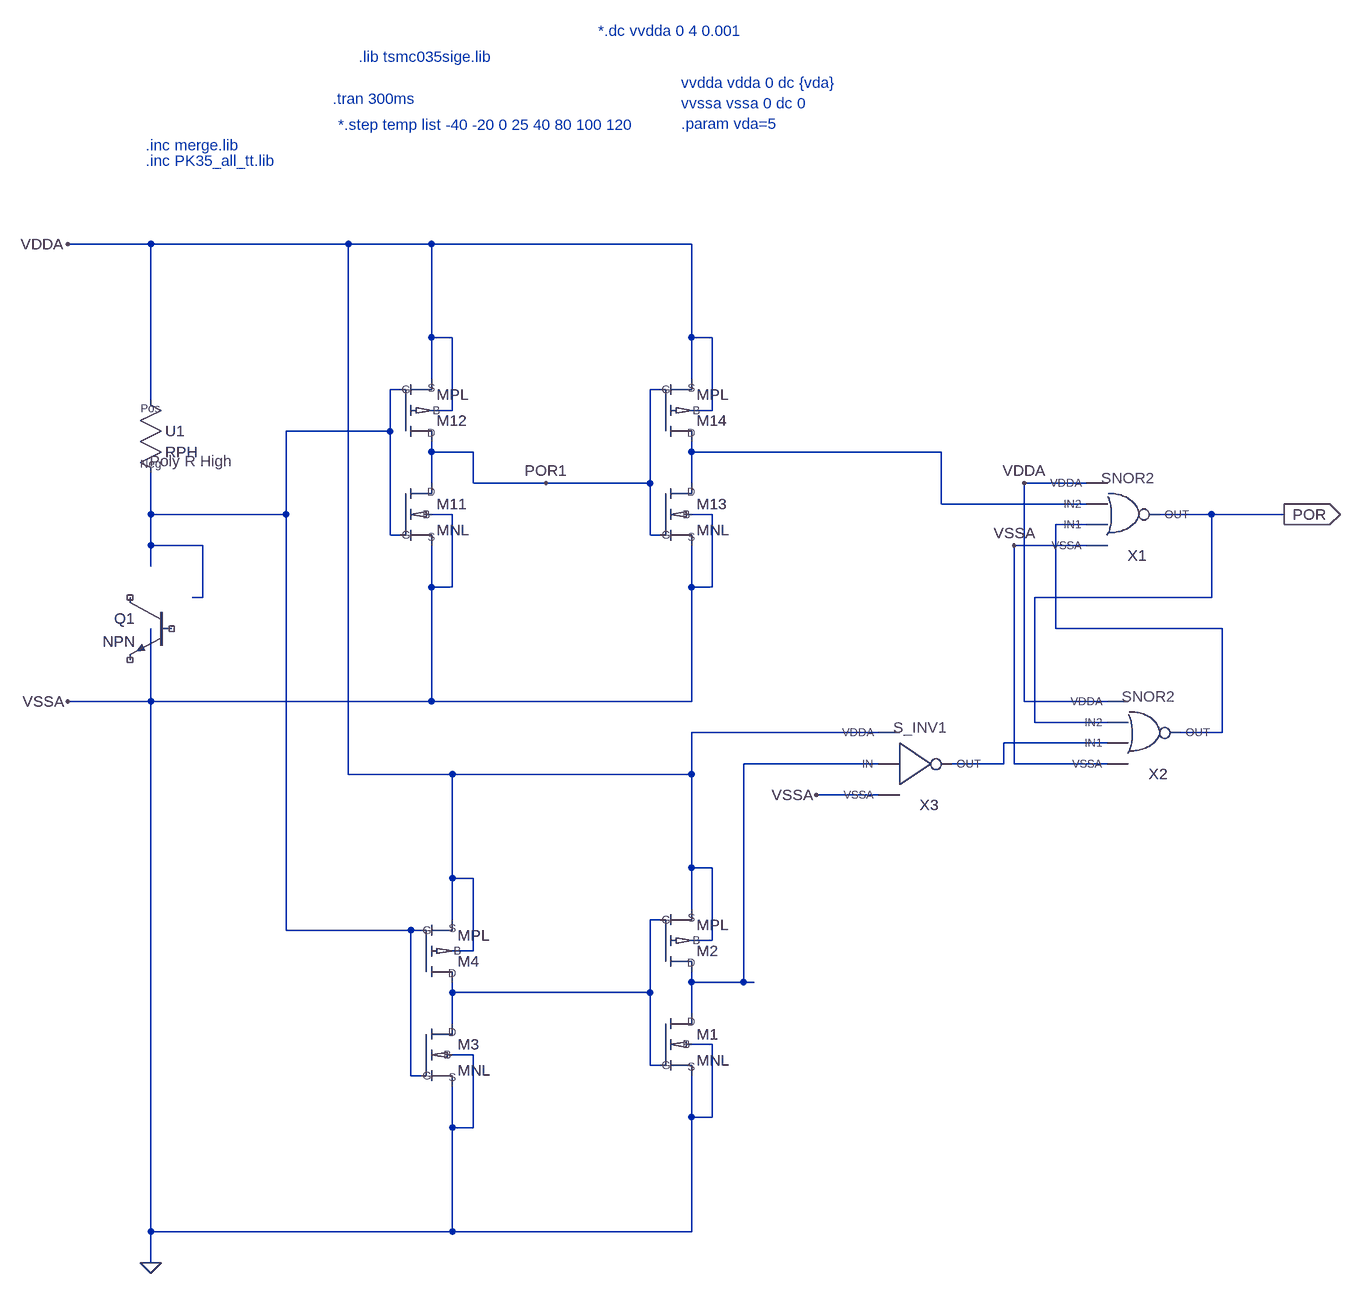
[diagram p0: schematic PoweOnReset.asc]
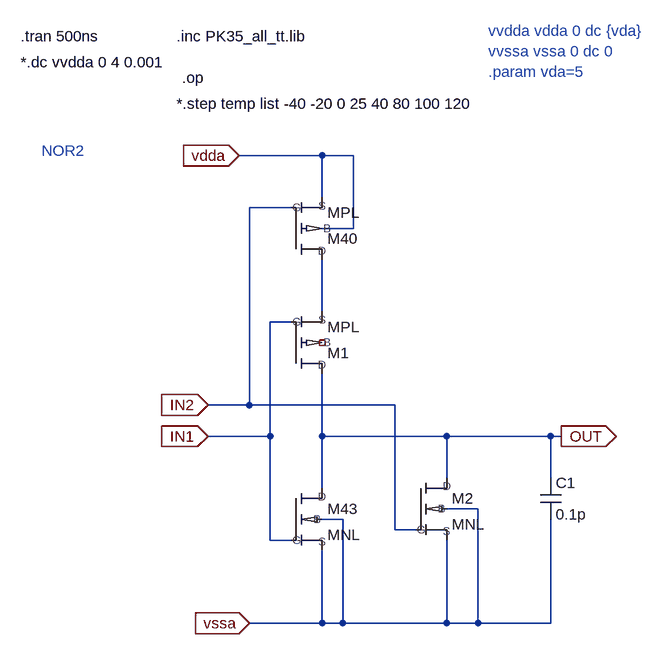
[diagram p1: sub-circuit s_nor2.asc]
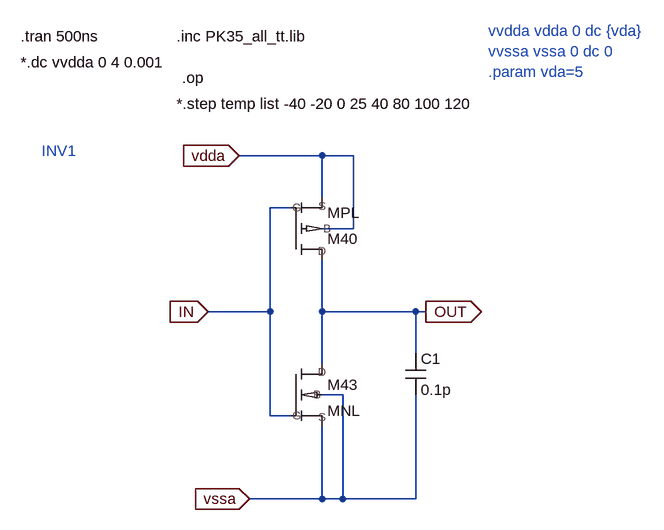
[diagram p2: sub-circuit s_inv1.asc]
PoweOnReset.asc, the LTspice schematic file:
Version 4
SHEET 1 5948 5172
WIRE 784 2160 656 2160
WIRE 1088 2160 784 2160
WIRE 1216 2160 1088 2160
WIRE 1616 2160 1216 2160
WIRE 1216 2304 1216 2160
WIRE 1248 2304 1216 2304
WIRE 1616 2304 1616 2160
WIRE 1648 2304 1616 2304
WIRE 1216 2368 1216 2304
WIRE 1616 2368 1616 2304
WIRE 1168 2384 1152 2384
WIRE 1568 2384 1552 2384
WIRE 784 2400 784 2160
WIRE 1248 2416 1248 2304
WIRE 1248 2416 1216 2416
WIRE 1648 2416 1648 2304
WIRE 1648 2416 1616 2416
WIRE 1152 2448 1152 2384
WIRE 1152 2448 992 2448
WIRE 1216 2480 1216 2464
WIRE 1280 2480 1216 2480
WIRE 1616 2480 1616 2464
WIRE 2000 2480 1616 2480
WIRE 1216 2528 1216 2480
WIRE 1280 2528 1280 2480
WIRE 1392 2528 1280 2528
WIRE 1552 2528 1552 2384
WIRE 1552 2528 1392 2528
WIRE 1616 2528 1616 2480
WIRE 2224 2528 2128 2528
WIRE 2000 2560 2000 2480
WIRE 2224 2560 2000 2560
WIRE 784 2576 784 2512
WIRE 992 2576 992 2448
WIRE 992 2576 784 2576
WIRE 1248 2576 1216 2576
WIRE 1648 2576 1616 2576
WIRE 2416 2576 2336 2576
WIRE 2528 2576 2416 2576
WIRE 2224 2592 2176 2592
WIRE 1152 2608 1152 2448
WIRE 1168 2608 1152 2608
WIRE 1552 2608 1552 2528
WIRE 1568 2608 1552 2608
WIRE 784 2624 784 2576
WIRE 864 2624 784 2624
WIRE 2224 2624 2112 2624
WIRE 784 2656 784 2624
WIRE 1216 2688 1216 2624
WIRE 1248 2688 1248 2576
WIRE 1248 2688 1216 2688
WIRE 1616 2688 1616 2624
WIRE 1648 2688 1648 2576
WIRE 1648 2688 1616 2688
WIRE 864 2704 864 2624
WIRE 864 2704 848 2704
WIRE 2416 2704 2416 2576
WIRE 2416 2704 2144 2704
WIRE 2176 2752 2176 2592
WIRE 2432 2752 2176 2752
WIRE 784 2864 784 2752
WIRE 784 2864 656 2864
WIRE 1216 2864 1216 2688
WIRE 1216 2864 784 2864
WIRE 1616 2864 1616 2688
WIRE 1616 2864 1216 2864
WIRE 2128 2864 2128 2528
WIRE 2256 2864 2128 2864
WIRE 2144 2896 2144 2704
WIRE 2256 2896 2144 2896
WIRE 1904 2912 1616 2912
WIRE 2432 2912 2432 2752
WIRE 2432 2912 2368 2912
WIRE 2256 2928 2096 2928
WIRE 1904 2960 1696 2960
WIRE 2096 2960 2096 2928
WIRE 2096 2960 2016 2960
WIRE 2112 2960 2112 2624
WIRE 2256 2960 2112 2960
WIRE 1088 2976 1088 2160
WIRE 1248 2976 1088 2976
WIRE 1616 2976 1616 2912
WIRE 1616 2976 1248 2976
WIRE 1904 3008 1808 3008
WIRE 1616 3120 1616 2976
WIRE 1648 3120 1616 3120
WIRE 1248 3136 1248 2976
WIRE 1280 3136 1248 3136
WIRE 1616 3184 1616 3120
WIRE 1248 3200 1248 3136
WIRE 1568 3200 1552 3200
WIRE 992 3216 992 2576
WIRE 1184 3216 992 3216
WIRE 1200 3216 1184 3216
WIRE 1648 3232 1648 3120
WIRE 1648 3232 1616 3232
WIRE 1280 3248 1280 3136
WIRE 1280 3248 1248 3248
WIRE 1616 3296 1616 3280
WIRE 1696 3296 1696 2960
WIRE 1696 3296 1616 3296
WIRE 1712 3296 1696 3296
WIRE 1248 3312 1248 3296
WIRE 1552 3312 1552 3200
WIRE 1552 3312 1248 3312
WIRE 1616 3344 1616 3296
WIRE 1248 3360 1248 3312
WIRE 1648 3392 1616 3392
WIRE 1280 3408 1248 3408
WIRE 1552 3424 1552 3312
WIRE 1568 3424 1552 3424
WIRE 1184 3440 1184 3216
WIRE 1200 3440 1184 3440
WIRE 1616 3504 1616 3440
WIRE 1648 3504 1648 3392
WIRE 1648 3504 1616 3504
WIRE 1248 3520 1248 3456
WIRE 1280 3520 1280 3408
WIRE 1280 3520 1248 3520
WIRE 784 3680 784 2864
WIRE 1248 3680 1248 3520
WIRE 1248 3680 784 3680
WIRE 1616 3680 1616 3504
WIRE 1616 3680 1248 3680
WIRE 784 3728 784 3680
FLAG 656 2864 VSSA
FLAG 656 2160 VDDA
FLAG 2528 2576 POR
IOPIN 2528 2576 Out
FLAG 784 3728 0
FLAG 1808 3008 VSSA
FLAG 2128 2528 VDDA
FLAG 2112 2624 VSSA
FLAG 1392 2528 POR1
SYMBOL MNL 1200 2576 R0
SYMATTR InstName M11
SYMATTR SpiceLine l=1.2u w=20u pd=w+l+l ps=pd ad=w*l as=ad m=1
SYMBOL MPL 1200 2416 M180
SYMATTR InstName M12
SYMATTR SpiceLine l=2.0u w=5u pd=w+l+l ps=pd ad=w*l as=ad m=1
SYMBOL MNL 1600 2576 R0
SYMATTR InstName M13
SYMATTR SpiceLine l=1.2u w=10u pd=w+l+l ps=pd ad=w*l as=ad m=1
SYMBOL MPL 1600 2416 M180
SYMATTR InstName M14
SYMATTR SpiceLine l=2.0u w=5u pd=w+l+l ps=pd ad=w*l as=ad m=1
SYMBOL S_NOR2 2256 2576 R0
SYMATTR InstName X1
SYMBOL S_NOR2 2288 2912 R0
SYMATTR InstName X2
SYMBOL S_INV1 1936 2960 R0
SYMATTR InstName X3
SYMBOL RPH 784 2448 R0
SYMATTR InstName U1
SYMATTR SpiceLine l=100u w=4u m=4
SYMBOL MNL 1600 3392 R0
SYMATTR InstName M1
SYMATTR SpiceLine l=1.2u w=10u pd=w+l+l ps=pd ad=w*l as=ad m=1
SYMBOL MPL 1600 3232 M180
SYMATTR InstName M2
SYMATTR SpiceLine l=2.0u w=5u pd=w+l+l ps=pd ad=w*l as=ad m=1
SYMBOL MNL 1232 3408 R0
SYMATTR InstName M3
SYMATTR SpiceLine l=1.2u w=20u pd=w+l+l ps=pd ad=w*l as=ad m=1
SYMBOL MPL 1232 3248 M180
SYMATTR InstName M4
SYMATTR SpiceLine l=2.0u w=4.5u pd=w+l+l ps=pd ad=w*l as=ad m=1
SYMBOL NPN 816 2704 M0
SYMATTR InstName Q1
TEXT 1104 1872 Left 2 ;.lib tsmc035sige.lib
TEXT 1600 1912 Left 2 ;vvdda vdda 0 dc {vda}\nvvssa vssa 0 dc 0\n.param vda=5
TEXT 1472 1832 Left 2 ;*.dc vvdda 0 4 0.001
TEXT 1072 1976 Left 2 ;*.step temp list -40 -20 0 25 40 80 100 120
TEXT 776 2032 Left 2 ;.inc PK35_all_tt.lib
TEXT 776 2008 Left 2 ;.inc merge.lib
TEXT 1064 1936 Left 2 ;.tran 300ms

s_nor2.asc, the sub-circuit schematic file:
Version 4
SHEET 1 5948 5172
WIRE 896 -1344 768 -1344
WIRE 944 -1344 896 -1344
WIRE 896 -1280 896 -1344
WIRE 848 -1264 784 -1264
WIRE 944 -1232 944 -1344
WIRE 944 -1232 896 -1232
WIRE 896 -1104 896 -1184
WIRE 848 -1088 816 -1088
WIRE 784 -960 784 -1264
WIRE 784 -960 720 -960
WIRE 1008 -960 784 -960
WIRE 816 -912 816 -1088
WIRE 816 -912 720 -912
WIRE 896 -912 896 -1008
WIRE 1088 -912 896 -912
WIRE 1248 -912 1088 -912
WIRE 1264 -912 1248 -912
WIRE 1088 -848 1088 -912
WIRE 1248 -848 1248 -912
WIRE 896 -832 896 -912
WIRE 1136 -800 1088 -800
WIRE 928 -784 896 -784
WIRE 1008 -768 1008 -960
WIRE 1040 -768 1008 -768
WIRE 816 -752 816 -912
WIRE 848 -752 816 -752
WIRE 896 -624 896 -736
WIRE 896 -624 784 -624
WIRE 928 -624 928 -784
WIRE 928 -624 896 -624
WIRE 1088 -624 1088 -752
WIRE 1088 -624 928 -624
WIRE 1136 -624 1136 -800
WIRE 1136 -624 1088 -624
WIRE 1248 -624 1248 -784
WIRE 1248 -624 1136 -624
FLAG 768 -1344 vdda
IOPIN 768 -1344 In
FLAG 784 -624 vssa
IOPIN 784 -624 In
FLAG 720 -912 IN1
IOPIN 720 -912 In
FLAG 1264 -912 OUT
IOPIN 1264 -912 Out
FLAG 720 -960 IN2
IOPIN 720 -960 In
SYMBOL MPL 880 -1232 M180
SYMATTR InstName M40
SYMATTR SpiceLine l=0.8u w=6.6u pd=w+l+l ps=pd ad=w*l as=ad m=1
SYMBOL MNL 880 -784 R0
SYMATTR InstName M43
SYMATTR SpiceLine l=0.8u w=3.3u pd=w+l+l ps=pd ad=w*l as=ad m=1
SYMBOL cap 1232 -848 R0
SYMATTR InstName C1
SYMATTR Value 0.1p
SYMBOL MPL 880 -1056 M180
SYMATTR InstName M1
SYMATTR SpiceLine l=0.8u w=6.6u pd=w+l+l ps=pd ad=w*l as=ad m=1
SYMBOL MNL 1072 -800 R0
SYMATTR InstName M2
SYMATTR SpiceLine l=0.8u w=3.3u pd=w+l+l ps=pd ad=w*l as=ad m=1
TEXT 1152 -1536 Left 2 ;vvdda vdda 0 dc {vda}\nvvssa vssa 0 dc 0\n.param vda=5
TEXT 432 -1488 Left 2 !*.dc vvdda 0 4 0.001
TEXT 672 -1424 Left 2 !*.step temp list -40 -20 0 25 40 80 100 120
TEXT 680 -1464 Left 2 !.op
TEXT 672 -1528 Left 2 !.inc PK35_all_tt.lib
TEXT 432 -1528 Left 2 !.tran 500ns
TEXT 464 -1352 Left 2 ;NOR2

s_inv1.asc, the sub-circuit schematic file:
Version 4
SHEET 1 5948 5172
WIRE 896 -1344 768 -1344
WIRE 944 -1344 896 -1344
WIRE 896 -1280 896 -1344
WIRE 848 -1264 816 -1264
WIRE 944 -1232 944 -1344
WIRE 944 -1232 896 -1232
WIRE 816 -1104 816 -1264
WIRE 816 -1104 720 -1104
WIRE 896 -1104 896 -1184
WIRE 1040 -1104 896 -1104
WIRE 1056 -1104 1040 -1104
WIRE 1040 -1040 1040 -1104
WIRE 896 -1024 896 -1104
WIRE 928 -976 896 -976
WIRE 816 -944 816 -1104
WIRE 848 -944 816 -944
WIRE 896 -816 896 -928
WIRE 896 -816 784 -816
WIRE 928 -816 928 -976
WIRE 928 -816 896 -816
WIRE 1040 -816 1040 -976
WIRE 1040 -816 928 -816
FLAG 768 -1344 vdda
IOPIN 768 -1344 In
FLAG 784 -816 vssa
IOPIN 784 -816 In
FLAG 720 -1104 IN
IOPIN 720 -1104 In
FLAG 1056 -1104 OUT
IOPIN 1056 -1104 Out
SYMBOL MPL 880 -1232 M180
SYMATTR InstName M40
SYMATTR SpiceLine l=0.8u w=6.6u pd=w+l+l ps=pd ad=w*l as=ad m=1
SYMBOL MNL 880 -976 R0
SYMATTR InstName M43
SYMATTR SpiceLine l=0.8u w=3.3u pd=w+l+l ps=pd ad=w*l as=ad m=1
SYMBOL cap 1024 -1040 R0
SYMATTR InstName C1
SYMATTR Value 0.1p
TEXT 1152 -1536 Left 2 ;vvdda vdda 0 dc {vda}\nvvssa vssa 0 dc 0\n.param vda=5
TEXT 432 -1488 Left 2 !*.dc vvdda 0 4 0.001
TEXT 672 -1424 Left 2 !*.step temp list -40 -20 0 25 40 80 100 120
TEXT 680 -1464 Left 2 !.op
TEXT 672 -1528 Left 2 !.inc PK35_all_tt.lib
TEXT 432 -1528 Left 2 !.tran 500ns
TEXT 464 -1352 Left 2 ;INV1

The netlist it stands for:
* PoweOnReset.asc
XM11 POR1 N001 0 0 MNL l=1.2u w=20u pd=w+l+l ps=pd ad=w*l as=ad m=1  ; pins D G S B
XM12 POR1 N001 VDDA VDDA MPL l=2.0u w=5u pd=w+l+l ps=pd ad=w*l as=ad m=1  ; pins D G S B
XM13 N002 POR1 0 0 MNL l=1.2u w=10u pd=w+l+l ps=pd ad=w*l as=ad m=1  ; pins D G S B
XM14 N002 POR1 VDDA VDDA MPL l=2.0u w=5u pd=w+l+l ps=pd ad=w*l as=ad m=1  ; pins D G S B
XX1 N002 VDDA POR 0 N003 s_nor2
XX2 POR VDDA N003 0 N004 s_nor2
XX3 N005 VDDA N004 0 s_inv1
XU1 VDDA N001 RPH l=100u w=4u m=4  ; pins Pos Neg
XM1 N005 N006 0 0 MNL l=1.2u w=10u pd=w+l+l ps=pd ad=w*l as=ad m=1  ; pins D G S B
XM2 N005 N006 VDDA VDDA MPL l=2.0u w=5u pd=w+l+l ps=pd ad=w*l as=ad m=1  ; pins D G S B
XM3 N006 N001 0 0 MNL l=1.2u w=20u pd=w+l+l ps=pd ad=w*l as=ad m=1  ; pins D G S B
XM4 N006 N001 VDDA VDDA MPL l=2.0u w=4.5u pd=w+l+l ps=pd ad=w*l as=ad m=1  ; pins D G S B
* Q1: NPN (symbol NPN not certain, pin order unknown); nets seen at it: 0

* block symbol definitions
.subckt s_nor2 IN2 VDDA OUT VSSA IN1
XM40 N001 IN2 vdda vdda MPL l=0.8u w=6.6u pd=w+l+l ps=pd ad=w*l as=ad m=1  ; pins D G S B
XM43 OUT IN1 vssa vssa MNL l=0.8u w=3.3u pd=w+l+l ps=pd ad=w*l as=ad m=1  ; pins D G S B
C1 OUT vssa 0.1p
XM1 OUT IN1 N001 NC_01 MPL l=0.8u w=6.6u pd=w+l+l ps=pd ad=w*l as=ad m=1  ; pins D G S B
XM2 OUT IN2 vssa vssa MNL l=0.8u w=3.3u pd=w+l+l ps=pd ad=w*l as=ad m=1  ; pins D G S B
* vvdda vdda 0 dc {vda}
* vvssa vssa 0 dc 0
* .param vda=5
*.dc vvdda 0 4 0.001
*.step temp list -40 -20 0 25 40 80 100 120
.op
.inc PK35_all_tt.lib
.tran 500ns
* NOR2
.ends s_nor2

.subckt s_inv1 IN VDDA OUT VSSA
XM40 OUT IN vdda vdda MPL l=0.8u w=6.6u pd=w+l+l ps=pd ad=w*l as=ad m=1  ; pins D G S B
XM43 OUT IN vssa vssa MNL l=0.8u w=3.3u pd=w+l+l ps=pd ad=w*l as=ad m=1  ; pins D G S B
C1 OUT vssa 0.1p
* vvdda vdda 0 dc {vda}
* vvssa vssa 0 dc 0
* .param vda=5
*.dc vvdda 0 4 0.001
*.step temp list -40 -20 0 25 40 80 100 120
.op
.inc PK35_all_tt.lib
.tran 500ns
* INV1
.ends s_inv1

* .lib tsmc035sige.lib
* vvdda vdda 0 dc {vda}
* vvssa vssa 0 dc 0
* .param vda=5
* *.dc vvdda 0 4 0.001
* *.step temp list -40 -20 0 25 40 80 100 120
* .inc PK35_all_tt.lib
* .inc merge.lib
* .tran 300ms
.backanno
.end